# EAGLE design EEZ DIB AUX PS r3B3 (EAGLE 7.2.0)
Assembly variants: Farnell, TME

## Sheet 1 of 2: Power board tester
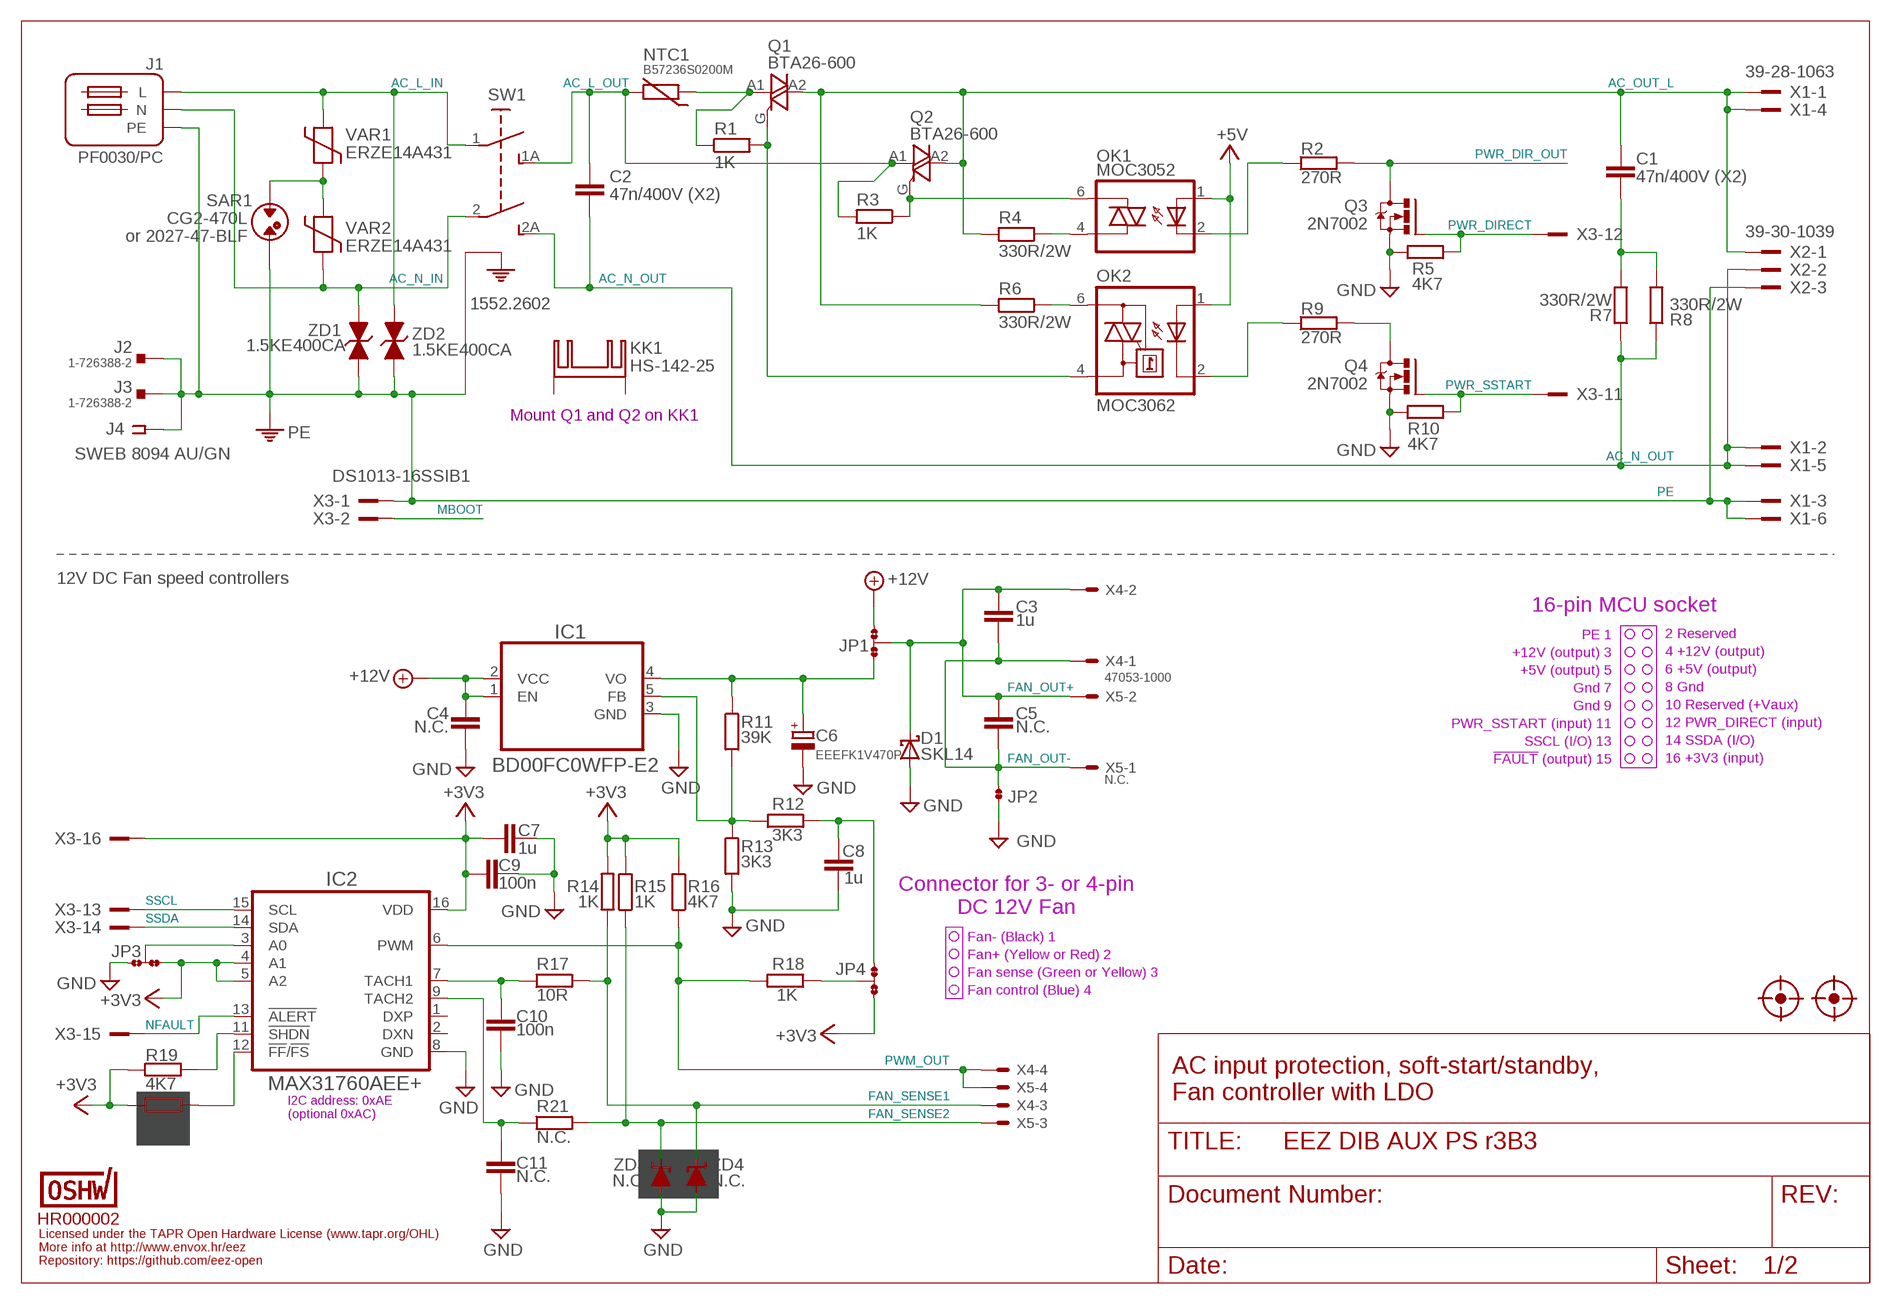
[diagram p0: schematic, sheet 1]

### Parts
C1  47n/400V (X2)  C-EU102-054X133  [C102-054X133]
C2  47n/400V (X2)  C-EU102-054X133  [C102-054X133]
C3  1u  C-EUC0805  [C0805]
C4  N.C.  C-EUC0805  [C0805]
C5  N.C.  C-EUC0805  [C0805]
C6  EEEFK1V470P  ECAPPANASONIC_H  [CAPAE660X610N]
C7  1u  C-EUC0805  [C0805]
C8  1u  C-EUC0805  [C0805]
C9  100n  C-EUC0603  [C0603]
C10  100n  C-EUC0603  [C0603]
C11  N.C.  C-EUC0603  [C0603]
D1  SKL14  SCHOTTKYSOD123  [SOD123]
FM1  FIDUCIAL  [FIDUCIAL]
FM2  FIDUCIAL  [FIDUCIAL]
IC1  BD00FC0WFP-E2  BD00FC0W  [TO-252-5]
IC2  MAX31760AEE+  [DBQ16]
J1  PF0030/PC  [PF0030/PC]
J2  1-726388-2  PCB_TAB4.8MM  [PCB_TAB-4.8MM]
J3  1-726388-2  PCB_TAB4.8MM  [PCB_TAB-4.8MM]
J4  SWEB 8094 AU/GN  BINDING_POSTCLIFF  [S16N-PC]
JP1  JP3-CUT  [JP3-CUT]
JP2  JP2-NOCUT  [JP2-NOCUT]
JP3  JP3-CUT  [JP3-CUT]
JP4  JP3-CUT  [JP3-CUT]
KK1  HS-142-25  SK129-PAD  [SK129]
NTC1  B57236S0200M  NTC11.5X6  [NTC_11.5X6_RM5]
OK1  MOC3052  MOC305X  [DIL6-SMD]
OK2  MOC3062  MOC3033S  [DIL6-SMD]
OSHWA  HR000002  OSHWA-CERT-SMALL  [CERT-SMALL-SILK]
Q1  BTA26-600  BTA26-V  [TOP3S-1]
Q2  BTA26-600  BTA26-V  [TOP3S-1]
Q3  2N7002  [SOT103P240X110-3N]
Q4  2N7002  [SOT103P240X110-3N]
R1  1K  R-EU_R0805  [R0805]
R2  270R  R-EU_R0805  [R0805]
R3  1K  R-EU_R0805  [R0805]
R4  330R/2W  R-EU_R2512  [R2512]
R5  4K7  R-EU_R0805  [R0805]
R6  330R/2W  R-EU_R2512  [R2512]
R7  330R/2W  R-EU_R2512  [R2512]
R8  330R/2W  R-EU_R2512  [R2512]
R9  270R  R-EU_R0805  [R0805]
R10  4K7  R-EU_R0805  [R0805]
R11  39K  R-EU_R0805  [R0805]
R12  3K3  R-EU_R0805  [R0805]
R13  3K3  R-EU_R0805  [R0805]
R14  1K  R-EU_R0805  [R0805]
R15  1K  R-EU_R0805  [R0805]
R16  4K7  R-EU_R0805  [R0805]
R17  10R  R-EU_R0805  [R0805]
R18  1K  R-EU_R0805  [R0805]
R19  4K7  R-EU_R0805  [R0805]
R20  N.C.  R-EU_R0805  [R0805]
R21  N.C.  R-EU_R0805  [R0805]
SAR1  CG2-470L  SAR  [SAR]
SW1  1552.2602  DF62J12S2AHQA  [DF62J12S2]
VAR1  ERZE14A431  VARISTOR-13  [VARISTOR_13MM]
VAR2  ERZE14A431  VARISTOR-13  [VARISTOR_13MM]
X1  39-28-1063  MINIFIT_5566-06A-CRE  [MINIFIT_5566-06A_CRE]
X2  39-30-1039  MINIFIT_39301039-CREEPAGE  [MINIFIT_39301039_CRE]
X3  DS1013-16SSIB1  IDC-16PIN  [IDC-16PIN]
X4  47053-1000  [47053-1000]
X5  N.C.  47053-1000  [47053-1000]
ZD1  1.5KE400CA  1.5KE-BIDIR  [DO201-BIDIR]
ZD2  1.5KE400CA  1.5KE-BIDIR  [DO201-BIDIR]
ZD3  N.C.  ZENER-DIODESOD123  [SOD123]
ZD4  N.C.  ZENER-DIODESOD123  [SOD123]

### Nets
12V_PWM: C6.1(+) IC1.4(VO) JP1.NC R11.1
+3V3: C7.2 C9.2 IC2.4(A1) IC2.5(A2) IC2.16(VDD) JP3.NC JP4.NO R14.2 R15.2 R16.2 R19.2 R20.2 X3.16
+5V: OK1.1(A) OK2.1(A) ; also sheet 2
+12V: C4.1 IC1.1(EN) IC1.2(VCC) JP1.NO ; also sheet 2
AC_L_IN: J1.L SW1.1(P) VAR1.2 ZD2.A
AC_L_OUT: C2.1 NTC1.1 Q2.A1 R3.2 SW1.1A(S) ; also sheet 2
AC_N_IN: J1.N SW1.2(P1) VAR2.1 ZD1.A
AC_N_OUT: C2.2 R7.1 R8.1 SW1.2A(S1) X1.2 X1.5 X2.2 ; also sheet 2
AC_OUT_L: C1.1 Q1.A2 Q2.A2 R4.2 R6.2 X1.1 X1.4 X2.1
FAN_OUT+: C3.1 C5.1 D1.C JP1.COM X4.2 X5.2
FAN_OUT-: C3.2 C5.2 JP2.2 X4.1 X5.1
FAN_SENSE1: R14.1 R17.2 X4.3 ZD4.C
FAN_SENSE2: R15.1 R21.2 X5.3 ZD3.C
GND [gnd]: C4.2 C6.2(-) C7.1 C8.2 C9.1 C10.2 C11.2 D1.A IC1.3(GND) IC2.8(GND) JP2.1 JP3.NO Q3.2(S) Q4.2(S) R5.1 R10.1 R13.2 ZD3.A ZD4.A ; also sheet 2
LDO_FB: IC1.5(FB) R11.2 R12.1 R13.1
MBOOT: X3.2
N$1: NTC1.2 Q1.A1 R1.1
N$2: C10.1 IC2.7(TACH1) R17.1
N$3: IC2.12(!FF!/!FS!) R20.1
N$4: JP4.COM R18.1
N$6: SAR1.P$1 VAR1.1 VAR2.2
N$7: OK2.2(C) R9.1
N$9: C8.1 JP4.NC R12.2
N$10: OK1.2(C) R2.1
N$16: Q4.3(D) R9.2
N$18: IC2.11(!SHDN) R19.1
N$21: C11.1 IC2.9(TACH2) R21.1
N$23: IC2.3(A0) JP3.COM
N$71: OK1.6(A2) Q2.G R3.1
N$72: OK2.4(A1) Q1.G R1.2
N$73: OK2.6(A2) R6.1
N$76: OK1.4(A1) R4.1
N$83: C1.2 R7.2 R8.2
NFAULT: IC2.13(!ALERT) X3.15
PE: J1.PE J2.1 J2.2 J3.1 J3.2 J4.1 J4.NC1 J4.NC2 J4.NC3 J4.NC4 SAR1.P$2 SW1.PE1(PE) SW1.PE2(PE) X1.3 X1.6 X2.3 X3.1 ZD1.C ZD2.C
PWM_OUT: IC2.6(PWM) R16.1 R18.2 X4.4 X5.4
PWR_DIR_OUT: Q3.3(D) R2.2 ; also sheet 2
PWR_DIRECT: Q3.1(G) R5.2 X3.12
PWR_SSTART: Q4.1(G) R10.2 X3.11
SSCL: IC2.15(SCL) X3.13
SSDA: IC2.14(SDA) X3.14
Unconnected: IC2.1(DXP) IC2.2(DXN) KK1.A2,5(K) KK1.B2,5(K) X3.10

### Notes on the sheet
- or 2027-47-BLF
- Mount Q1 and Q2 on KK1
- 12V DC Fan speed controllers
- 16-pin MCU socket
- PE 1
- 2 Reserved
- +12V (output) 3
- 4 +12V (output)
- +5V (output) 5
- 6 +5V (output)
- Gnd 7
- 8 Gnd
- Gnd 9
- 10 Reserved (+Vaux)
- PWR_SSTART (input) 11
- 12 PWR_DIRECT (input)
- SSCL (I/O) 13
- 14 SSDA (I/O)
- !FAULT! (output) 15
- 16 +3V3 (input)
- Connector for 3- or 4-pin
  DC 12V Fan
- Fan- (Black) 1
- Fan+ (Yellow or Red) 2
- Fan sense (Green or Yellow) 3
- Fan control (Blue) 4
- AC input protection, soft-start/standby,
  Fan controller with LDO
- I2C address: 0xAE
  (optional 0xAC)
- Licensed under the TAPR Open Hardware License (www.tapr.org/OHL)
- More info at http://www.envox.hr/eez
- Repository: https://github.com/eez-open

## Sheet 2 of 2
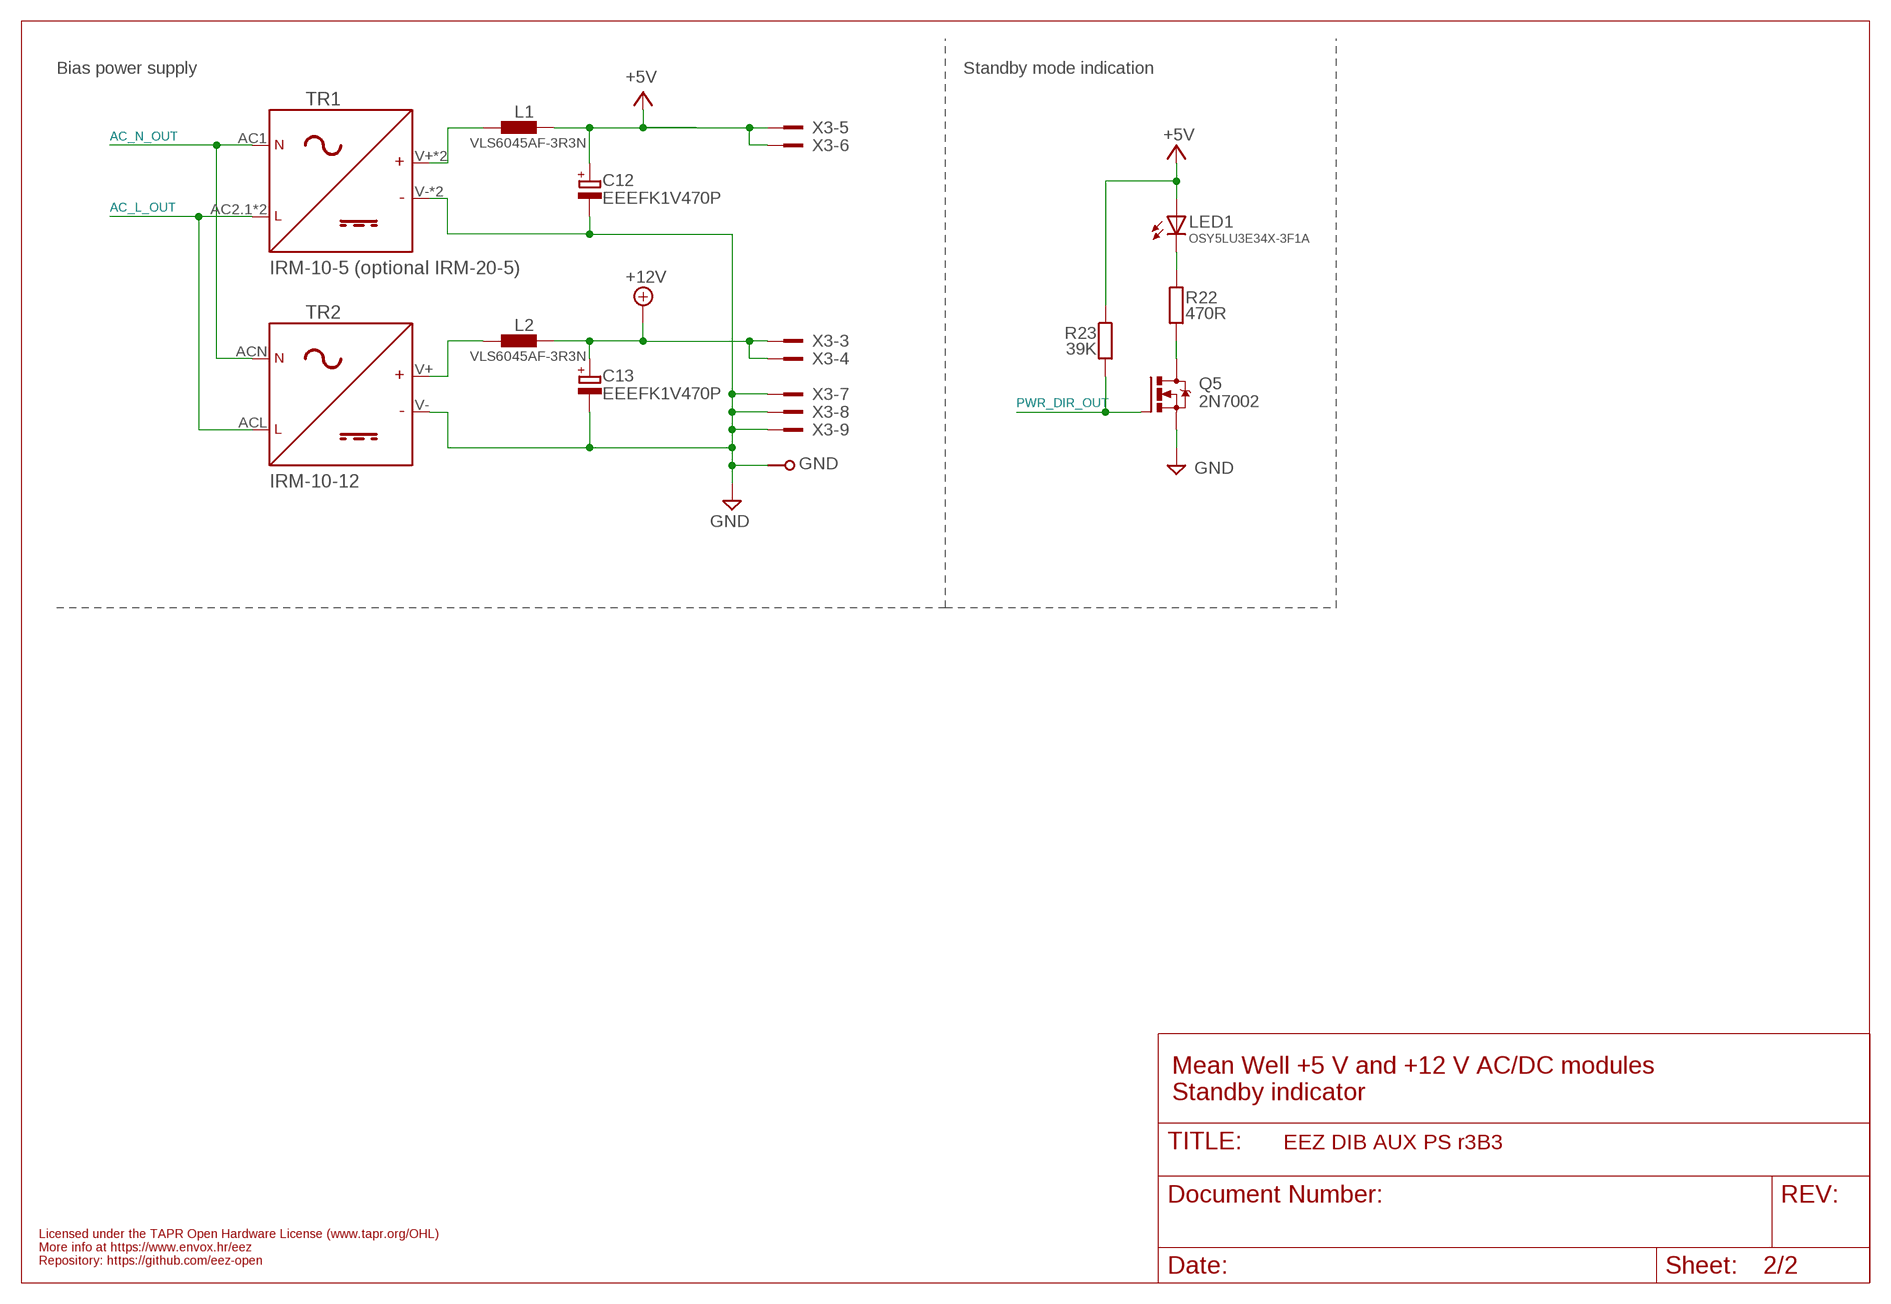
[diagram p1: schematic, sheet 2]

### Parts
C12  EEEFK1V470P  ECAPPANASONIC_H  [CAPAE660X610N]
C13  EEEFK1V470P  ECAPPANASONIC_H  [CAPAE660X610N]
GND  PCB_TEST_TABSHIELD  [PCB_SHIELD_TAB]
L1  VLS6045AF-3R3N  COILCRAFT_HPI0630  [COILCRAFT_HPI0630]
L2  VLS6045AF-3R3N  COILCRAFT_HPI0630  [COILCRAFT_HPI0630]
LED1  OSY5LU3E34X-3F1A  LEDOSG8  [OSG8]
Q5  2N7002  [SOT103P240X110-3N]
R22  470R  R-EU_R0805  [R0805]
R23  39K  R-EU_R0805  [R0805]
TR1  IRM-10-5 (optional IRM-20-5)  AC_DC_ADAPTERIRM10/20  [IRM-10/20_COMBO]
TR2  IRM-10-12  AC_DC_ADAPTERIRM10  [IRM-10]

### Nets
+5V: C12.1(+) L1.2 LED1.A R23.1 X3.5 X3.6 ; also sheet 1
+12V: C13.1(+) L2.2 X3.3 X3.4 ; also sheet 1
AC_L_OUT: TR1.AC2.1(AC/L) TR1.AC2.2(AC/L) TR2.ACL(AC/L) ; also sheet 1
AC_N_OUT: TR1.AC1(AC/N) TR2.ACN(AC/N) ; also sheet 1
GND [gnd]: C12.2(-) C13.2(-) GND.1 Q5.2(S) TR1.V-1(-) TR1.V-(-) TR2.V-(-) X3.7 X3.8 X3.9 ; also sheet 1
N$8: L2.1 TR2.V+(+)
N$13: Q5.3(D) R22.2
N$14: LED1.C R22.1
N$15: L1.1 TR1.V+1(+) TR1.V+(+)
PWR_DIR_OUT: Q5.1(G) R23.2 ; also sheet 1

### Notes on the sheet
- Bias power supply | Standby mode indication
- Mean Well +5 V and +12 V AC/DC modules
  Standby indicator
- Licensed under the TAPR Open Hardware License (www.tapr.org/OHL)
- More info at https://www.envox.hr/eez
- Repository: https://github.com/eez-open

## Library data of the parts
C1-C5 C7-C11 = rcl:C-EU: CAPACITOR, European symbol
C6 C12 C13 = EEZ_Lib1:ECAP
D1 = EEZ_Lib1:SCHOTTKY
FM1 FM2 = EEZ_Lib1:FIDUCIAL: Fiducial mark for pick and place automation
GND = EEZ_Lib1:PCB_TEST_TAB
IC1 = EEZ_DIB:BD00FC0W: Single-Output low saturation 1A LDO Regulator
IC2 = EEZ_DIB:MAX31760AEE+: Precision Fan-Speed Controller with Nonvolatile Lookup Table
J1 = EEZ_connectors:PF0030/PC: PC Flanged Mount Fused Inlet, twin fused 5 x 20 mm, 250 Vac, 10 A, PC spills
J2 J3 = EEZ_connectors:PCB_TAB: PCB quick-fit terminal
J4 = EEZ_Lib1:BINDING_POST: Various 4 mm binding posts
JP1 JP3 JP4 = EEZ_Lib1:JP3-CUT
JP2 = EEZ_Lib1:JP2-NOCUT
KK1 = EEZ_DIB:SK129-PAD: Extruded heatsink; SOT32,TO220,TO3P; L:25.4mm; 7.8K/W Compatible model: Stonecold HS-142-25
L1 L2 = EEZ_inductors_and_transformers:COILCRAFT_HPI0630: High power inductor
LED1 = EEZ_Lib1:LED
NTC1 = EEZ_Lib1:NTC
OK1 = EEZ_Lib1:MOC305X: 6-pin DIP Random-phase Optoisolators Triac Drivers (600V Peak)
OK2 = optocoupler:MOC30*: 6-Pin DIP Zero-Cross Optoisolators Triac Driver Output (250/400 Volt Peak) Source: http://www.fairchildsemi.com/ds/MO/MOC3043-M.pdf; MF: FAIRCHILD SEMICONDUCTOR; MPN: MOC3033S-M; OC_FARNELL: unknown; OC_NEWARK: 05C2878
OSHWA = EEZ_Lib1:OSHWA-CERT
Q1 Q2 = triac:BTA26: 25A TRIAC Source: http://www.st.com/stonline/products/literature/ds/7470.pdf
Q3-Q5 = EEZ_Lib1:2N7002: N-CHANNEL ENHANCEMENT MODE FIELD EFFECT TRANSISTOR; MPN: 2N7002-7-F; OC_FARNELL: 1713823; OC_NEWARK: 25R5679; PACKAGE: SOT-23-3; SUPPLIER: DIODES INC.
R1-R23 = rcl:R-EU_: RESISTOR, European symbol
SAR1 = EEZ_Lib1:SAR: EPCOS surge arrester EF470X Farnell: 1886596
SW1 = EEZ_switches:DF62J12S2: Rocker switch SPST; Positions:2; OFF-ON; 16A/250VAC; 6A/48VDC
TR1 TR2 = EEZ_Lib1:AC_DC_ADAPTER: MYRRA 47202 AC/DC PCB Mount Power Supply, Switch Mode, Fixed, 1 Output
VAR1 VAR2 = EEZ_Lib1:VARISTOR: EPCOS - B72220S0251K101 - VARISTOR, 140J, 250VAC Farnell: 1004357
X1 = EEZ_connectors:MINIFIT_5566-06A: Molex Socket; wire-board; male; Mini-Fit Jr; 4.2mm; PIN:6; THT; 9A; tinned
X2 = EEZ_connectors:MINIFIT_39301039: MOLEX socket; wire-board; male; Mini-Fit Jr; 4.2mm; PIN:3; THT; PCB snap
X3 = EEZ_connectors:IDC-16PIN: 16-pin IDC socket
X4 X5 = EEZ_connectors:47053-1000: KK 254 Vertical Header, with Friction Lock, 4 Circuits, PC Tail Length: 3.50mm
ZD1 ZD2 = EEZ_Lib1:1.5KE-BIDIR
ZD3 ZD4 = EEZ_Lib1:ZENER-DIODE

## Net classes
0 default: width 0.152 mm, drill 0.3 mm, clearance 0.152 mm
1 diff: width 0.254 mm, drill 0.3 mm, clearance 0.254 mm
2 gnd: width 0.152 mm, drill 0.3 mm, clearance 0.152 mm

## Board
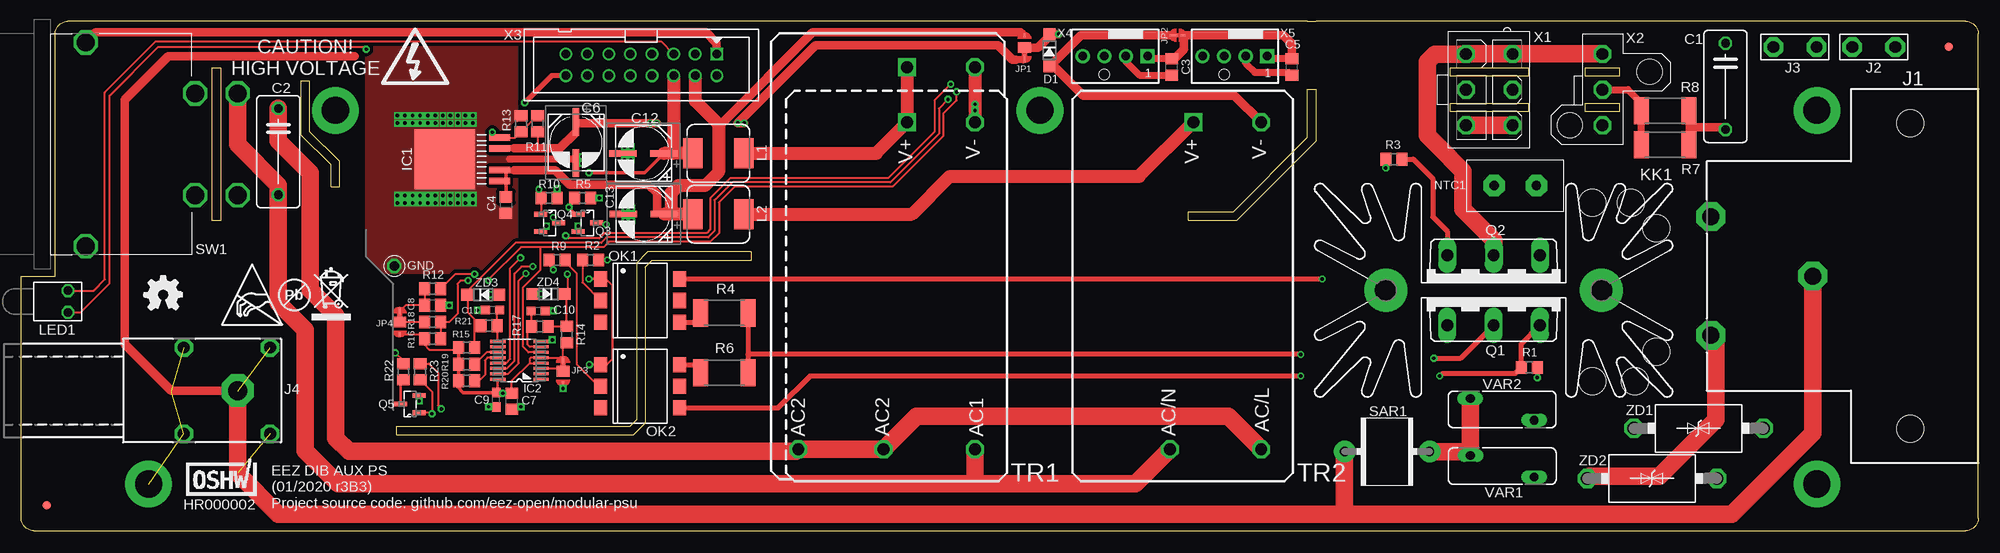
[diagram p2: board, top side]
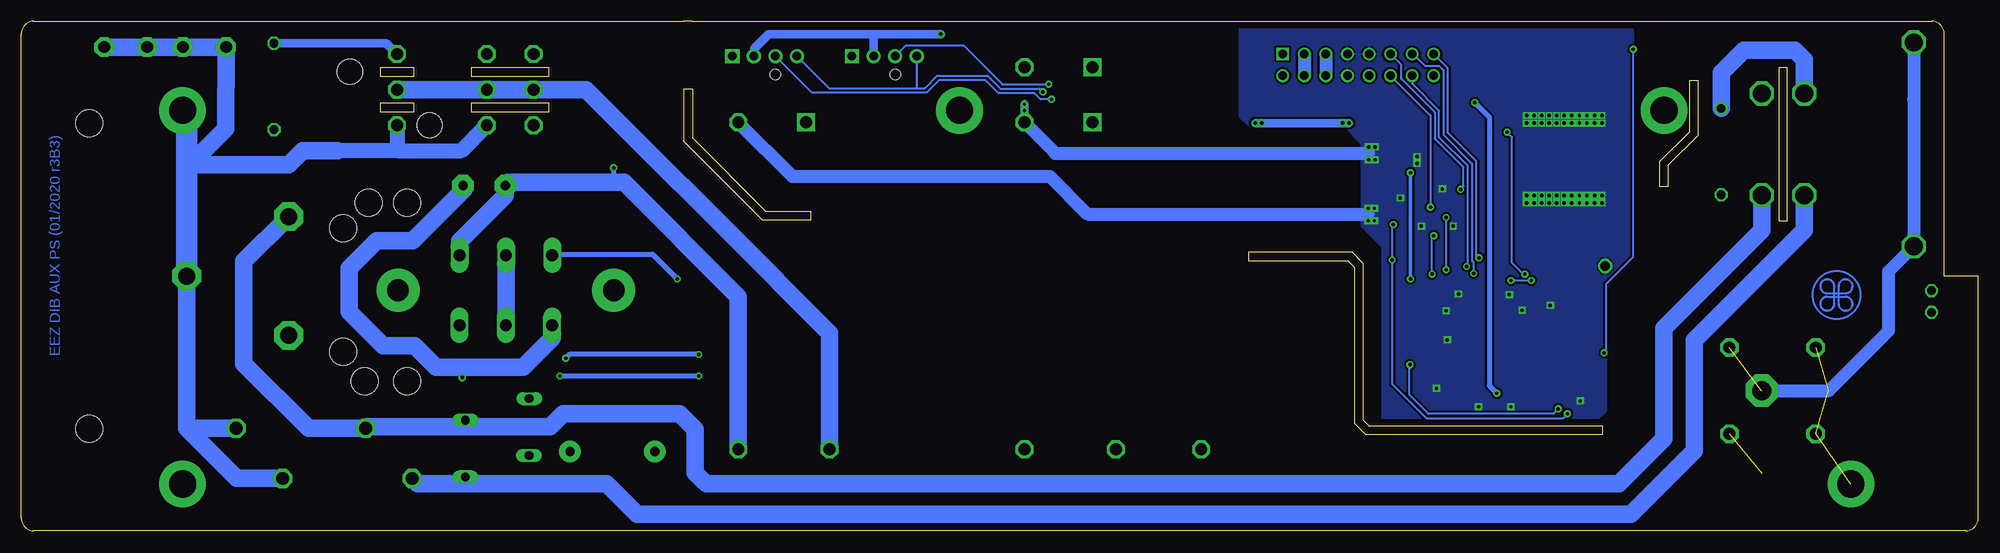
[diagram p3: board, bottom side, seen from below]

Size 230.5 x 60 mm. Coordinates in mm from the lower left corner, seen from the top.
Outline: 1.5,0 229,0 arc90 230.5,1.5 230.5,58.5 arc90 229,60 152.5,60 151.5,60 5.5,60 arc90 4,58.5 4,30 0,30 0,1.5 arc90 1.5,0
Outline: 73.47,12.64 72.14,11.3 44.2,11.3 44.2,12.32 71.69,12.32 72.45,13.08 72.45,31.5 73.79,32.83 85.98,32.83 85.98,31.81 74.23,31.81 73.47,31.05 73.47,12.64
Outline: 33,46.6 33,53 34,53 34,47 37.5,43.5 37.5,40.5 36.5,40.5 36.5,43.1 33,46.6
Outline: 152.46,52.01 152.46,45.85 143.19,36.58 137.48,36.58 137.48,37.59 142.75,37.59 151.45,46.29 151.45,52.01 152.46,52.01
Copper layers (1*16): Top 0.035mm / dielectric 1.5mm / Bottom 0.035mm
Design rules "default *": minimum track width 6mil, minimum drill 0.3mm, track to track 4mil, track to pad 4mil, pad to pad 4mil, via to via 4mil, smd to smd 4mil, copper to edge 30mil, drill to drill 8mil, minimum pad ring 4mil, minimum via ring 8mil, stop-mask expansion 2.5mil, vias tented up to drill 0.6mm, thermal gap 8mil
Holes 3.2 mm at 185.07,17.6 190.07,17.6 185.07,38.6 189.57,38.6 192.57,35.6 192.57,21.1

### Footprints (pad centres in the part's own frame; a part is rotated, then mirrored left to right if it is on the bottom)
C102-054X133 = drill 1.016 octagon: 1 -5.08,0; 2 5.08,0
C0805 = smd 1.3 x 1.5: 1 -0.95,0; 2 0.95,0
CAPAE660X610N = smd 3.251 x 0.762: 1 -2.413,0; 2 2.413,0
C0603 = smd 1.1 x 1: 1 -0.85,0; 2 0.85,0
SOD123 = smd 1.4 x 1.4: A 1.9,0; C -1.9,0
FIDUCIAL = smd 1.016 x 1.016: T 0,0
PCB_SHIELD_TAB = drill 1.1 octagon: 1 0,0
TO-252-5 = smd 0.762 x 2.489: 1 -2.54,-6.413; 2 -1.27,-6.413; 4 1.27,-6.413; 5 2.54,-6.413 | smd 7.112 x 7.112: 3 0,0
DBQ16 = smd 1.803 x 0.356: 1 -2.553,2.223; 2 -2.553,1.587; 3 -2.553,0.953; 4 -2.553,0.318; 5 -2.553,-0.318; 6 -2.553,-0.953; 7 -2.553,-1.587; 8 -2.553,-2.223; 9 2.553,-2.223; 10 2.553,-1.587; 11 2.553,-0.953; 12 2.553,-0.318; 13 2.553,0.318; 14 2.553,0.953; 15 2.553,1.587; 16 2.553,2.223
PF0030/PC = drill 2 pad 3.4 octagon: L -7,31.5; N 7,31.5; PE 0,19.5 | hole 3.2: 18,8; -18,8
PCB_TAB-4.8MM = drill 1.4 pad 2.3 octagon: 1 -2.54,0; 2 2.54,0
S16N-PC = drill 2.2 pad 3.81 octagon: 1 0,0 | drill 1.4 pad 2.184 octagon: NC1 -3.8,5.08; NC2 -3.8,-5.08; NC3 6.36,5.08; NC4 6.36,-5.08
JP3-CUT = smd 1.27 x 1.524: COM 0,0 | smd 0.889 x 0.254: NC -1.27,0 | smd 0.508 x 0.254: NO 1.46,0
JP2-NOCUT = smd 0.889 x 0.254: 1 -0.445,0 | smd 0.508 x 0.254: 2 0.635,0
SK129 = drill 2.54 pad 5.08: A2,5 -12.7,-0.889; B2,5 12.7,-0.889
COILCRAFT_HPI0630 = smd 2.3 x 3.5: 1 -3,0; 2 3,0
OSG8 = drill 1 octagon: A 0,1.27; C 0,-1.27
NTC_11.5X6_RM5 = drill 1.1 pad 2.54 octagon: 1 -2.5,0; 2 2.5,0
DIL6-SMD = smd 1.78 x 1.52: 1 -2.54,-4.645; 2 0,-4.645; 3 2.54,-4.645; 4 2.54,4.645; 5 0,4.645; 6 -2.54,4.645
TOP3S-1 = drill 1.397 long: A1 -5.461,-3.175; A2 0,-3.175; G 5.461,-3.175
SOT103P240X110-3N = smd 1.524 x 0.559: 1 -1.079,1.016; 2 -1.079,-1.016; 3 1.079,0
R0805 = smd 1.3 x 1.5: 1 -0.95,0; 2 0.95,0
R2512 = smd 1.8 x 3.2: 1 -2.8,0; 2 2.8,0
SAR = drill 1.1 pad 2.54: P$1 0,0; P$2 10,0
DF62J12S2 = drill 2.1 octagon: 1 17,-6; 1A 17,6; 2 22,-6; 2A 22,6; PE1 4.1,-12; PE2 4.1,12
IRM-10/20_COMBO = drill 1.4 octagon: AC1 3.75,3.75; AC2.1 3.75,14.5; AC2.2 3.75,24.55; V- 42.25,3.75; V-1 48.75,3.75 | drill 1.4 square: V+ 42.25,11.75; V+1 48.75,11.75
IRM-10 = drill 1.4 octagon: ACL 3.75,3.75; ACN 3.75,14.5; V- 42.25,3.75 | drill 1.4 square: V+ 42.25,11.75
VARISTOR_13MM = drill 1.016 long: 1 3.75,-1.27; 2 -3.75,1.27
MINIFIT_5566-06A_CRE = drill 1.4 octagon: 1 -4.2,2.75; 2 0,2.75; 3 4.2,2.75; 4 -4.2,-2.75; 5 0,-2.75; 6 4.2,-2.75
MINIFIT_39301039_CRE = drill 1.4 octagon: 1 0,4.2; 2 0,0; 3 0,-4.2 | hole 3: 5.55,2.1; -3.85,-4.2
IDC-16PIN = drill 1 pad 1.422 square: 1 -8.89,-1.27 | drill 1 pad 1.422: 2 -8.89,1.27; 3 -6.35,-1.27; 4 -6.35,1.27; 5 -3.81,-1.27; 6 -3.81,1.27; 7 -1.27,-1.27; 8 -1.27,1.27; 9 1.27,-1.27; 10 1.27,1.27; 11 3.81,-1.27; 12 3.81,1.27; 13 6.35,-1.27; 14 6.35,1.27; 15 8.89,-1.27; 16 8.89,1.27
47053-1000 = drill 1 pad 1.676 square: 1 3.81,0 | drill 1 pad 1.676: 2 1.27,0; 3 -1.27,0; 4 -3.81,0 | hole 1.25: -1.27,-2.16
DO201-BIDIR = drill 1.499 octagon: A 7.62,0; C -7.62,0

### Placement (x,y rotation side)
C1  200.72,52.32 270 top
C2  30.28,44.65 270 top
C3  135.51,54.61 90 top
C4  57.09,38.35 270 top
C5  149.67,54.61 90 top
C6  65.34,45.72 270 top
C7  57.78,15.24 90 top
C8  48.45,26.54 0 top
C9  55.94,15.43 90 top
C10  60.9,25.91 0 top
C11  55.5,25.97 180 top
C12  73.28,44.45 180 top
C13  73.34,37.27 180 top
D1  121.09,56.58 270 top
EEZ_SIGNATURE  SIGNATURESMALL  [SIGNATURE_5MM]  16.71,27.76 180 top
FM1  3,3 0 top
FM2  227,57 0 top
GND  43.94,31.18 180 top
IC1  49.91,43.75 90 top
IC2  58.67,20.07 180 top
J1  230.5,30 90 top
J2  218.19,56.96 180 top
J3  208.91,56.96 0 top
J4  25.5,16.5 180 top
JP1  118.17,56.9 90 top
JP2  136.21,58.36 0 top
JP3  63.82,18.8 270 top
JP4  44.58,24.57 270 top
KK1  173.42,29.21 0 top
L1  82.11,44.45 180 top
L2  82.11,37.27 180 top
LED1  5.5,27 0 top
NTC1  175.96,40.64 0 top
OK1  72.9,27.11 270 top
OK2  72.9,17.02 270 top
OSHWA  23.56,4.13 0 top
Q1  173.42,27.37 0 top
Q2  173.42,29.27 180 top
Q3  66.67,36.26 0 top
Q4  62.23,36.26 0 top
Q5  45.78,14.92 180 top
R1  177.61,19.24 180 top
R2  67.06,31.88 0 top
R3  161.67,43.75 180 top
R4  82.8,25.65 0 top
R5  66.1,39.18 180 top
R6  82.8,18.61 0 top
R7  193.61,45.47 0 top
R8  193.61,49.47 0 top
R9  63.12,31.88 180 top
R10  62.17,39.18 180 top
R11  60.83,47.94 90 top
R12  48.45,28.51 180 top
R13  58.86,47.94 90 top
R14  64.26,23.11 270 top
R15  52.45,21.59 180 top
R16  48.45,22.61 180 top
R17  61.09,24.07 0 top
R18  48.45,24.57 0 top
R19  52.45,19.62 180 top
R20  52.45,17.65 180 top
R21  55.12,24.13 180 top
R22  45.02,18.73 270 top
R23  46.99,18.73 270 top
SAR1  165.86,9.33 180 top
SW1  3.5,45.5 0 top
TR1  116.08,5.84 90 top
TR2  149.8,5.84 90 top
U$2  [PB_SMALL]  32.16,27.78 180 top
U$3  [RECYCLE_BIN1/8]  34.2,24.8 0 top
U$4  [ESD_SYMBOL]  23.62,24.27 0 top
VAR1  174.43,7.61 180 top
VAR2  174.43,14.29 0 top
X1  172.91,51.94 270 top
X2  186.25,51.94 0 top
X3  73.03,54.86 180 top
X4  128.84,55.88 0 top
X5  142.94,55.88 0 top
ZD1  197.56,12.06 180 top
ZD2  192.08,6.16 180 top
ZD3  54.42,27.81 0 top
ZD4  62.1,27.88 180 top

### Tracks (layer width: path | path; a pad name or v marks a point on that pad's centre or on a via)
12V_PWM  (via drill 0.4)
  Top 0.254: 60.83,44.96 60.9,45.02 | R11.1 60.83,45.09 60.77,45.02
  Top 0.406: 65.22,46.8 65.22,48.01 C6.1 65.47,48.01 65.53,48.01
  Top 0.711: 58.04,45.02 IC1.4
  Top 0.813: JP1.NC 118.17,55.56 118.05,55.44 117.16,55.44
  Top 1.016: 58.04,45.02 60.77,45.02 60.9,45.02 63.44,45.02 65.22,46.8 | 117.16,55.44 116.78,55.44 115.06,57.15 93.53,57.15 v84.39,48.01 v85.15,48.01 | v74.87,48.01 65.53,48.01
  Bottom 1.016: v85.15,48.01 v74.87,48.01 v74.11,48.01
+3V3  (via drill 0.4)
  Top 0.254: 55.77,17.84 IC2.16 55.69,17.84 55.44,17.78 | C7.2 57.78,17.65 59.88,19.75 | 59.88,19.75 IC2.4 | R14.2 63.82,21.72 JP3.NC 63.5,20.38 IC2.5 60.01,20.38 59.88,20.26 59.88,19.75 | JP4.NO 46.99,23.11 R16.2 47.5,21.91 48.07,21.34 51.25,21.34 R15.2
  Top 0.305: 56.07,17.79 IC2.16 56.12,16.28 C9.2
  Top 0.406: R15.2 R19.2 R20.2 51.44,17.59 51.44,16.89 52.05,16.28 C9.2
  Top 0.61: 57.91,15.94 C7.2 v56.71,16.19 56.71,16.28 56.12,16.28 | X3.16 62.48,53.59 v59.31,50.42
  Bottom 0.61: v56.71,16.19 57.59,17.08 57.59,48.7 v59.31,50.42
+5V  (via drill 0.4)
  Top 0.254: LED1.A 8.52,28.27 9.84,29.59 9.84,51.63 15.85,57.63 75.34,57.63 X3.5 | R23.1 48.01,19.68 49.09,18.61 49.09,14.73 v49.47,14.35 | OK2.1 v66.93,19.56
  Top 0.305: OK2.1 68.96,19.56 69.66,20.26 69.66,28.83 68.83,29.65 OK1.1 v66.86,29.65
  Top 0.406: 75.31,44.45 C12.1 73.41,42.16 v66.86,42.16
  Top 1.524: L1.2 76.77,44.45 | 76.77,44.45 C12.1 | X3.6 76.83,44.51 76.77,44.45
  Bottom 0.254: v49.47,14.35 50.04,13.78 64.77,13.78 66.99,16 66.99,19.49 v66.93,19.56
  Bottom 0.406: v66.86,42.16 v66.86,29.65
  Bottom 1.524: X3.5 X3.6
+12V
  Top 0.254: 57.09,41.47 IC1.1
  Top 0.406: C4.1 57.09,41.47 57.09,42.48 57.21,42.48
  Top 0.61: C13.1 75.06,37.27 74.87,37.47
  Top 0.711: IC1.2 57.21,42.48 58.04,42.48
  Top 0.813: 117.67,58.67 117.86,58.67 JP1.NO
  Top 1.016: 117.67,58.67 93.22,58.67 82.42,47.88 82.11,47.88 | 74.87,37.4 74.87,37.47 74.87,39.75 73.85,40.77 64.58,40.77 62.87,42.48 58.04,42.48
  Top 1.524: L2.2 76.26,37.27 | 76.26,37.27 C13.1 | X3.4 79.38,50.61 82.11,47.88 82.11,42.23 80.52,40.64 77.41,40.64 76.52,39.75 76.52,37.53 76.26,37.27
  Bottom 1.524: X3.3 X3.4
AC_L_IN
  Top 2.032: J1.L 199.58,22.42 199.58,13.08 192.91,6.41 184.71,6.41 ZD2.A
  Bottom 0.61: VAR1.2 178.19,5.66 178.05,5.52
  Bottom 2.032: SW1.1 20.5,35.38 33.47,22.42 33.47,9.4 40.89,1.97 157.99,1.97 161.54,5.52 178.05,5.52 183.82,5.52 ZD2.A
AC_L_OUT  (via drill 0.4)
  Top 0.61: R3.2 v160.72,42.74
  Top 2.032: C2.1 30.29,45.91 34.04,42.16 34.04,28.38 37.02,25.4 37.02,10.92 38.6,9.34 91.27,9.34 TR1.AC2.2 TR1.AC2.1 105.45,13.46 142.18,13.46 TR2.ACL
  Bottom 0.61: 166.05,40.89 166.18,41.02 | 146.11,27.24 146.05,27.18 | v160.72,42.74 160.72,41.02
  Bottom 2.032: C2.1 30.29,53.91 27.62,56.58 21.59,56.58 20.5,55.49 SW1.1A | Q2.A1 178.88,34.1 173.52,39.46 NTC1.1 173.14,41.02 166.18,41.02 160.72,41.02 159.51,41.02 146.05,27.55 146.05,27.18 TR2.ACL
AC_N_IN
  Bottom 0.61: VAR2.1 178.18,12.26
  Bottom 2.032: SW1.2 25.5,35.4 37.02,23.88 37.02,10.86 42.35,5.52 149.8,5.52 149.86,5.59 150.24,5.97 151.13,6.86 151.13,11.94 152.97,13.78 166.69,13.78 168.21,12.26 178.18,12.26 189.75,12.26 ZD1.A | ZD1.A 196.66,12.06 204.28,19.68 204.28,31.72 J1.N | ZD1.A
AC_N_OUT
  Top 0.813: R7.1 R8.1 190.81,50.36 189.23,51.94 X2.2
  Top 2.032: SW1.2A 25.5,45.49 30.28,40.71 C2.2 30.28,26.87 33.47,23.69 33.47,9.4 37.34,5.52 112.39,5.52 | TR2.ACN 131.23,5.52 112.39,5.52 | TR1.AC1 112.33,5.59 112.39,5.52
  Bottom 2.032: X2.2 X1.2 X1.5 163.96,51.94 141.6,29.59 141.22,29.21 135.3,23.28 TR2.ACN
AC_OUT_L  (via drill 0.4)
  Top 0.61: R4.2 85.6,20.77 | 85.6,20.77 R6.2 | v166.37,20.32 169.54,20.32 Q1.A2 | v150.69,20.77 85.6,20.77
  Top 2.032: X2.1 X1.1 X1.4 166.5,56.13 165.61,55.24 165.61,46.55 168.02,44.13 168.62,43.53 169.8,42.35 169.8,37.85 173.42,34.23 Q2.A2
  Bottom 0.61: v150.69,20.77 165.93,20.77 v166.37,20.32
  Bottom 1.016: C1.1 187.51,57.4 X2.1
  Bottom 2.032: Q2.A2 Q1.A2
FAN_OUT+  (via drill 0.4)
  Top 0.813: X5.2 144.21,55.05 145.29,53.98 149.35,53.98 C5.1 | X4.2 130.11,55.24 131.7,53.66 C3.1
  Top 1.016: JP1.COM 119.76,56.9 120.77,57.91 D1.C v122.17,58.48
  Bottom 1.016: v122.17,58.48 130.24,58.48 | 130.24,58.48 142.49,58.48 144.21,56.77 X5.2 | X4.2 130.11,58.36 130.24,58.48
FAN_OUT-
  Top 0.813: C5.2 147.07,55.56 X5.1 | C3.2 132.97,55.56 X4.1 | JP2.2 136.97,58.36 137.1,58.36
  Top 1.016: 137.1,58.36 148.65,58.36 149.67,57.34 C5.2 | C3.2 135.82,55.56 136.97,56.71 136.97,58.36
FAN_SENSE1  (via drill 0.4)
  Top 0.254: 64.52,27.82 ZD4.C | v64.14,34.73 64.45,34.42 68.07,34.42 68.71,35.05 80.71,35.05 81.15,35.5 81.15,39.18 83.5,41.53 102.11,41.53 107.57,46.99 107.57,50.67 v109.47,52.58 | R17.2 R14.1 64.26,27.82 ZD4.C | v64.33,30.23 64.33,28.2 ZD4.C
  Bottom 0.254: X4.3 126.3,57.15 119.51,57.15 116.46,54.1 115.47,53.12 114.94,52.58 v109.47,52.58 | v64.33,30.23 64.33,34.54 v64.14,34.73
FAN_SENSE2  (via drill 0.4)
  Top 0.254: 52.64,27.69 52.64,25.66 53.4,24.9 53.4,24.19 | 52.64,27.69 ZD3.C | R15.1 53.4,24.19 | R21.2 53.47,24.13 53.4,24.19 | 52.64,27.69 52.64,28.32 55.56,31.24 55.69,31.37 58.23,33.91 68.33,33.91 68.96,34.54 80.9,34.54 81.66,35.31 81.66,38.92 83.76,41.02 102.36,41.02 108.08,46.74 108.08,49.72 v109.16,50.8
  Bottom 0.254: X5.3 137.41,51.63 123.83,51.63 122.36,53.09 116.97,53.09 115.44,51.56 111.19,51.56 110.43,50.8 v109.16,50.8
GND  (via drill 0.4)
  Top 0.254: ZD4.A v61.21,27.88 | C10.2 v62.67,25.91 | ZD3.A v55.24,27.81 | IC2.8 62.36,22.29 v62.55,22.48 | JP2.1 135.51,58.36 | v65.6,35.88 Q3.2 | C13.2 70.99,37.85 v71.12,37.97 | v71.06,45.21 71.06,44.64 C12.2 | Q4.2 61.78,35.24 61.78,35.81 v61.85,35.88 | v50.42,26.54 C8.2 | R10.1 v63.12,40.26 | v68.07,39.18 R5.1
  Top 0.305: v53.72,25.97 C11.2 | Q5.2 v46.86,15.3 | v63.82,16.76 JP3.NO | v58.86,14.61 C7.1
  Top 0.61: C9.1 v55.05,14.61 | C6.2 65.28,43.75
  Top 0.813: 65.28,43.75 57.47,43.75
  Top 1.016: 135.51,58.36 124.84,58.36 121.66,55.18 121.66,54.68 | D1.A 121.66,54.68 | 121.66,54.68 125.09,51.24 142.89,51.24 TR2.V-
  Top 1.524: TR1.V-1 TR1.V-
  Bottom 1.016: v112.33,50.23 v112.33,49.47 112.33,49.65 TR1.V-
  Bottom 1.524: TR2.V- 146.05,48.07 139.7,41.72 109.35,41.72 104.9,37.27 71.88,37.27 | TR1.V- 108.69,44.45 71.82,44.45
  other vias: 48.77,39.5 47.88,39.5 46.99,39.5 46.1,39.5 45.21,39.5 44.32,39.5 49.66,39.5 50.55,39.5 51.44,39.5 52.32,39.5 53.21,39.5 44.32,48.01 45.21,48.01 46.1,48.01 46.99,48.01 47.88,48.01 48.77,48.01 49.66,48.01 50.55,48.01 51.44,48.01 52.32,48.01 53.21,48.01 44.32,48.9 45.21,48.9 46.1,48.9 46.99,48.9 47.88,48.9 48.77,48.9 49.66,48.9 50.55,48.9 51.44,48.9 52.32,48.9 53.21,48.9 44.32,38.61 45.21,38.61 46.1,38.61 46.99,38.61 47.88,38.61 48.77,38.61 49.66,38.61 50.55,38.61 51.44,38.61 52.32,38.61 53.21,38.61 71.88,37.97 71.88,36.51 71.12,36.51 71.82,43.69 71.06,43.69 71.82,45.21 66.1,43.24 66.1,44.07
  pour Top (isolate 0.406, no thermals): 42.55,30.35 40.64,32.26 40.64,58.42 58.42,58.42 58.42,30.35
  pour Bottom (isolate 0.254): 70.23,12.83 45.15,12.83 43.81,14.16 43.81,29.08 40.64,32.26 40.64,60.64 87,60.64 87,48.77 85.79,47.56 74.61,47.56 72.64,45.59 72.64,35.88 70.23,33.46
  pour Top (isolate 0.406, no thermals): 42.55,30.35 40.64,32.26 40.64,58.42 58.42,58.42 58.42,30.35
HOLE_UL  (via drill 3.2 pad 5.5)
  other vias: 37,49.5
HOLE_UM  (via drill 3.2 pad 5.5)
  other vias: 120,49.5
HOLE_UR  (via drill 3.2 pad 5.5)
  other vias: 211.5,5.5
LDO_FB  (via drill 0.4)
  Top 0.254: R11.2 60.76,48.89 R13.1 58.16,46.29 IC1.5 56.26,46.16 v55.5,46.93 | 49.4,28.64 R12.1 51.12,30.23 v53.4,30.23
  Bottom 0.254: v53.4,30.23 53.59,30.23 54.93,31.56 54.93,46.35 v55.5,46.93
N$1  (via drill 0.4)
  Top 0.61: R1.1 178.56,18.73 v178.56,18.03
  Bottom 0.61: v178.56,18.03 R1.1
  Bottom 2.032: Q1.A1 167.96,22.67 171.39,19.24 R1.1 181.61,19.24 184.15,21.78 187.9,21.78 191.9,25.78 191.9,30.92 188.66,34.16 184.4,34.16 178.33,40.24 NTC1.2
N$2
  Top 0.254: IC2.7 59.88,21.65 59.63,21.91 59.63,23.56 R17.1 60.05,24.16 C10.1
N$3
  Top 0.254: IC2.12 54.93,20.38 54.61,20.07 54.61,18.35 53.91,17.65 R20.1
N$4
  Top 0.254: R18.1 JP4.COM
N$6
  Top 0.61: 170.69,9.27 170.69,9.01 VAR1.1 | 170.69,14.91 VAR2.2
  Top 2.032: 170.69,9.27 170.69,9.4 | 170.69,9.4 170.69,14.91 170.69,15.24 | SAR1.P$1 170.62,9.33 170.69,9.4
N$7
  Top 0.254: OK2.2 68.25,17.09 67.94,17.09 65.47,19.56 65.47,30.29 64.07,31.69 R9.1
  Top 0.305: 67.94,16.7 OK2.2
N$8
  Top 1.524: TR2.V+ 131.67,41.72 109.35,41.72 104.9,37.27 L2.1
N$9
  Top 0.254: R12.2 C8.1 45.28,26.54 JP4.NC
N$10
  Top 0.254: 68.14,27.56 68.14,27.11 OK1.2 66.11,29.26 R2.1
  Top 0.305: 67.74,26.6 OK1.2
N$13
  Top 0.305: Q5.3 44.7,17.46 R22.2
N$14  (via drill 0.4)
  Top 0.254: LED1.C 7,25.73 10.41,29.15 10.41,51.24 16.14,56.97 40.37,56.97 v40.64,56.71 | R22.1 45.02,20 v44.07,20.95
  Bottom 0.254: v40.64,56.71 40.64,32.26 43.81,29.08 43.81,21.21 v44.07,20.95
N$15
  Top 1.524: TR1.V+1 TR1.V+ 100.69,44.45 L1.1
N$16  (via drill 0.4)
  Top 0.254: 62.17,31.75 R9.2 62.17,31.75 | 62.17,31.75 62.17,31.24 v62.67,30.73 | Q4.3 62.67,36.26 v62.67,36.89
  Bottom 0.254: v62.67,30.73 v62.67,36.89
N$18
  Top 0.254: IC2.11 54.8,21.02 R19.1
N$21
  Top 0.254: C11.1 56.07,25.69 R21.1 56.12,24.08 IC2.9
N$23
  Top 0.254: IC2.3 63.5,19.11 JP3.COM
N$71  (via drill 0.4)
  Top 0.61: OK1.6 v153.23,29.65 | R3.1 163.96,43.75 166.24,41.47 166.24,36.96 167.96,35.24 Q2.G
  Bottom 0.61: Q2.G 167.96,32.58 156.15,32.58 v153.23,29.65
N$72  (via drill 0.4)
  Top 0.61: v150.69,18.22 92.9,18.22 89.15,14.48 OK2.4 | v167.07,18.22 167.39,18.54 175.96,18.54 R1.2 176.66,21.97 Q1.G
  Bottom 0.61: v150.69,18.22 v167.07,18.22
N$73
  Top 0.61: OK2.6 79.95,19.56 79.95,18.66 R6.1
N$76
  Top 0.61: OK1.4 79.88,24.57 79.95,24.64 79.95,25.6 R4.1
N$83
  Top 0.813: R8.2 196.41,47.5 | 196.41,47.5 R7.2 | 196.6,47.5 196.41,47.5
  Top 1.016: C1.2 200.47,47.5 196.6,47.5
NFAULT  (via drill 0.4)
  Top 0.254: IC2.13 57.09,19.75 57.59,20.26 57.59,30.92 v58.8,32.13
  Bottom 0.254: X3.15 62.48,54.48 62.48,46.86 59.12,43.5 59.12,32.38 58.86,32.13 v58.8,32.13
PE  (via drill 3.2 pad 5.5)  (6 unrouted)
  Top 0.61: 163.33,2.04 163.26,1.97 | 151.19,2.1 151.07,1.97
  Top 1.016: X3.1 81.92,57.4 80.64,58.67 8.77,58.67 SW1.PE2 | 39.24,55.88 17.34,55.88 12.19,50.74 12.19,21.97 17.65,16.51 25.53,16.51
  Top 2.032: 155.83,1.97 151.07,1.97 30.29,1.97 25.5,6.76 J4.1 | 155.83,1.97 163.26,1.97 201.49,1.97 211,11.48 J1.PE | SAR1.P$2 155.86,2 155.83,1.97 | X1.6 X1.3
  Bottom 1.016: 7.66,50.74 7.6,50.8
  Bottom 1.524: SW1.PE2 7.6,50.8 SW1.PE1 10.54,30.56 10.54,23.56 17.6,16.5 J4.1
  Bottom 1.778: 186.25,44.77 178.64,44.77 X1.3 | X2.3 186.25,44.77 | 186.25,44.77 193.23,44.77
  Bottom 2.032: 211,12.06 J1.PE | ZD1.C 211,12.06 | ZD2.C 205.09,6.16 211,12.06 | 211,43.31 211,43.05 210.94,43.12 210.63,43.12 | 193.23,44.77 197.36,44.77 199.01,43.12 210.63,43.12 | J2.1 J2.2 J3.2 | 211.5,56.87 J3.2 | 210.63,43.12 206.41,47.33 J3.1 J3.2
  Bottom 2.54: J1.PE 211,43.31 211,49 v211.5,49.5
  other vias: 15,5.5
PWM_OUT  (via drill 0.4)
  Top 0.254: IC2.6 59.75,21.02 59.12,21.65 59.12,28.7 61.09,30.67 61.09,33.4 | 61.09,33.4 68.58,33.4 69.22,34.04 81.15,34.04 82.17,35.05 82.17,38.67 84.01,40.51 102.62,40.51 108.58,46.48 108.58,49.09 110.17,50.67 v110.17,51.69 | R16.1 R18.2 50.42,24.57 51.37,25.53 51.37,29.08 51.75,29.46 v52.64,29.46 | 61.09,33.4 58.86,33.4 55.05,29.59 v55.05,29.46
  Bottom 0.254: X5.4 135.38,52.13 125.03,52.13 | X4.4 125.03,52.13 | v110.17,51.69 110.55,52.07 115.19,52.07 116.71,53.59 122.62,53.59 124.08,52.13 125.03,52.13 | v52.64,29.46 v55.05,29.46
PWR_DIR_OUT  (via drill 0.4)
  Top 0.254: Q5.1 48.26,13.91 v48.39,13.78 48.39,16.39 R23.2 | R2.2 v69.03,31.88 | Q3.3 68.71,36.26 v68.9,36.07
  Bottom 0.254: v48.39,13.78 48.9,13.27 65.02,13.27 69.03,17.27 v69.03,31.88 69.03,35.94 v68.9,36.07
PWR_DIRECT  (via drill 0.4)
  Top 0.254: 65.79,37.27 Q3.1 65.15,37.27 65.15,37.47 v64.52,38.1 65.15,38.73 R5.2
  Bottom 0.254: X3.12 64.52,48.9 v64.52,38.1
PWR_SSTART  (via drill 0.4)
  Top 0.254: R10.2 61.59,39.18 61.59,39.56 | R10.2 61.22,37.34 Q4.1 | v60.96,40.2 60.96,39.44 R10.2
  Bottom 0.254: X3.11 68.01,54.93 68.01,53.28 64.01,49.28 64.01,46.16 60.64,42.8 60.64,40.51 v60.96,40.2
SSCL  (via drill 0.4)
  Top 0.254: IC2.15 57.34,18.48 58.61,19.75 58.61,29.46 v59.44,30.29
  Bottom 0.254: X3.13 66.55,56.13 65.15,54.74 63.5,54.74 62.99,54.23 62.99,46.61 59.63,43.24 59.63,31.75 59.44,31.56 v59.44,30.29
SSDA  (via drill 0.4)
  Top 0.254: IC2.14 57.21,19.11 58.1,20 58.1,30.29 58.93,31.11 v60.26,31.11
  Bottom 0.254: X3.14 66.67,52.64 63.5,49.47 63.5,46.35 60.13,42.99 60.13,31.24 v60.26,31.11

### Text on the board
Bottom: EEZ DIB AUX PS (01/2020 r3B3)
tPlace: CAUTION! / HIGH VOLTAGE | EEZ DIB AUX PS / (01/2020 r3B3) / Project source code: github.com/eez-open/modular-psu